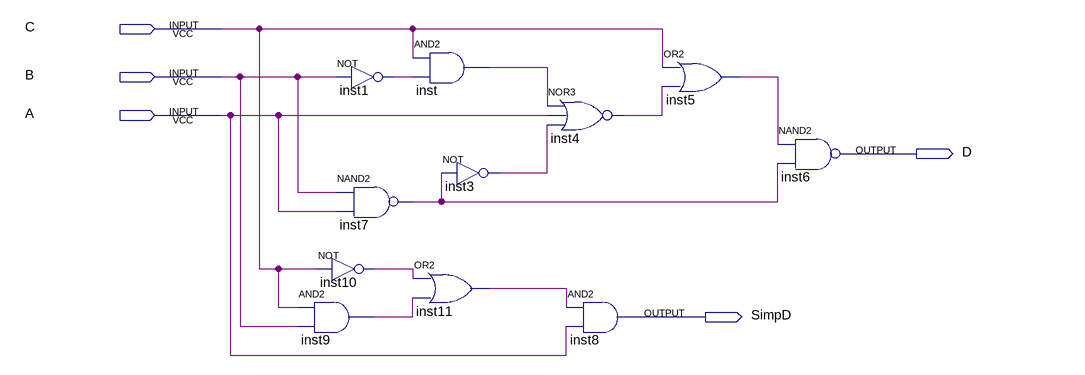
[diagram p0: schematic sheet]
// Quartus schematic Lab2.bdf as structural Verilog: 11 symbols, 5 pins
module Lab2 (
  input  C,
  input  B,
  input  A,
  output D,
  output SimpD
);

  wire inst1_out, inst3_out, inst4_out, inst5_out, inst7_out, inst9_out, inst10_out, inst11_out, inst_out;

  not inst10 (inst10_out, C);
  and inst9 (inst9_out, C, B);
  not inst1 (inst1_out, B);
  nand inst7 (inst7_out, B, A);
  and inst (inst_out, C, inst1_out);
  not inst3 (inst3_out, inst7_out);
  or inst11 (inst11_out, inst10_out, inst9_out);
  nor inst4 (inst4_out, inst_out, A, inst3_out);
  and inst8 (SimpD, inst11_out, A);
  or inst5 (inst5_out, C, inst4_out);
  nand inst6 (D, inst5_out, inst7_out);
endmodule
